# EAGLE design blinkmusb_b1_pcbjackmlf (EAGLE 5.11)
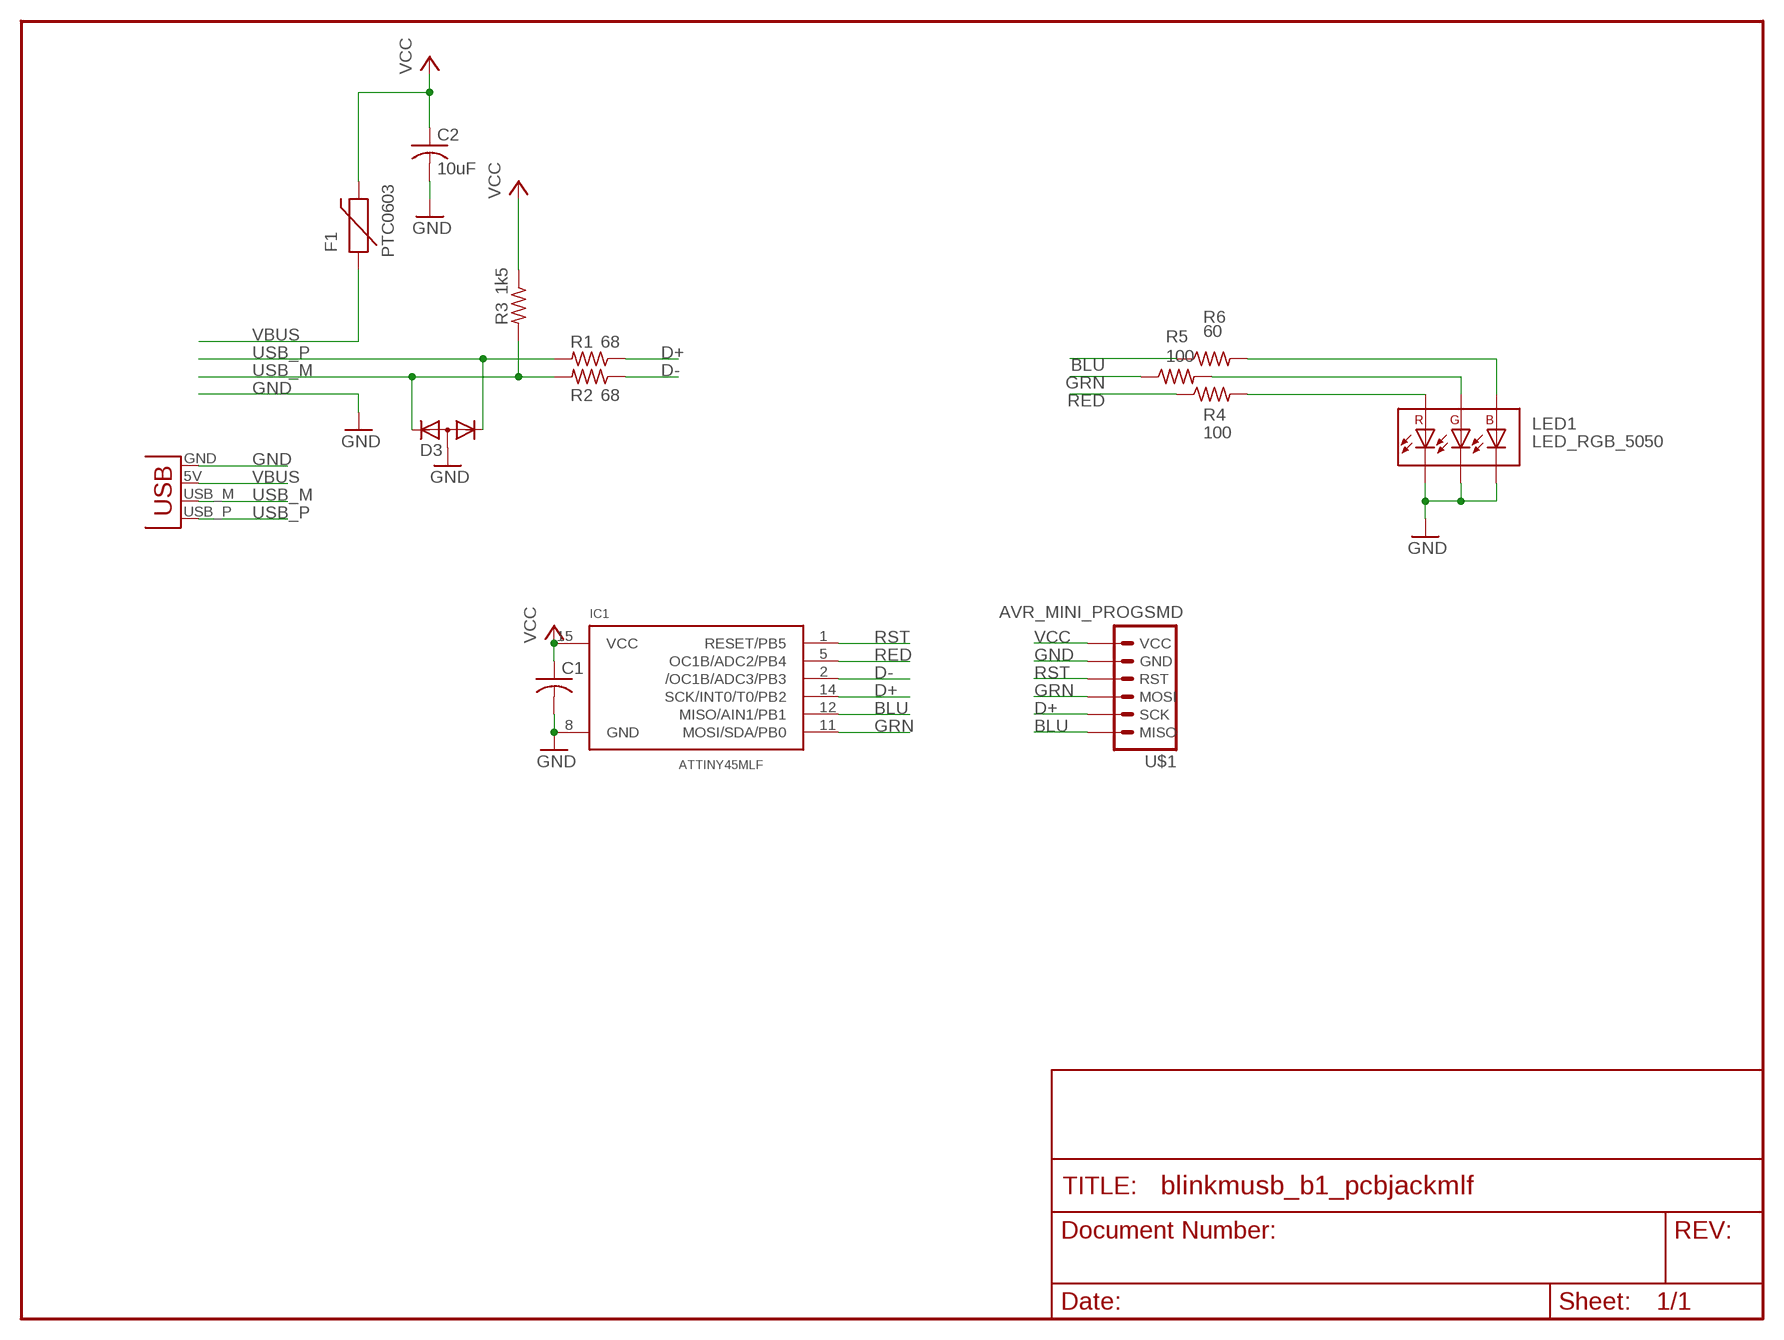
[diagram p0: schematic, sheet 1]

## Parts
C1  C-USC0603  [C0603]
C2  10uF  C-USC0805  [C0805]
D3  DIODE-2CA|ACSOT23  [SOT23]
F1  PTC0603  [0603]
IC1  ATTINY45MLF  [MLF20]
LED1  LED_RGB_5050  [LED_5050]
R1  68  R-US_R0603  [R0603]
R2  68  R-US_R0603  [R0603]
R3  1k5  R-US_R0603  [R0603]
R4  100  R-US_R0603  [R0603]
R5  100  R-US_R0603  [R0603]
R6  60  R-US_R0603  [R0603]
U$1  AVR_MINI_PROGSMD  [AVR_MINI_PROG]
X2  USBPCB  [USB-A-PCB]

## Nets
BLU: IC1.12(MISO/AIN1/PB1) R6.1 U$1.6(MISO)
D+: IC1.14(SCK/INT0/T0/PB2) R1.1 U$1.5(SCK)
D-: IC1.2(/OC1B/ADC3/PB3) R2.1
GND: C1.2 C2.2 D3.3(A) IC1.8(GND) LED1.P$4(C2) LED1.P$5(C1) LED1.P$6(C0) U$1.2(GND) X2.GND
GRN: IC1.11(MOSI/SDA/PB0) R5.1 U$1.4(MOSI)
RBLU: LED1.P$3(A2) R6.2
RED: IC1.5(OC1B/ADC2/PB4) R4.1
RGRN: LED1.P$2(A1) R5.2
RRED: LED1.P$1(A0) R4.2
RST: IC1.1(RESET/PB5) U$1.3(RST)
USB_M: D3.2(K2) R2.2 R3.2 X2.USB_M(D-)
USB_P: D3.1(K1) R1.2 X2.USB_P(D+)
VBUS: F1.1 X2.5V(VBUS)
VCC: C1.1 C2.1 F1.2 IC1.15(VCC) R3.1 U$1.1(VCC)

## Library data of the parts
C1 C2 = rcl:C-US: CAPACITOR, American symbol
D3 = diode:DIODE-2CA|AC: Dual DIODE Cathode-Anode|Anode-Cathode
F1 = SparkFun-20110517:PTC: Resettable Fuse PTC Resettable Fuse. Spark Fun Electronics SKU : COM-08357
IC1 = todstuff:ATTINY45
LED1 = todstuff:LED_RGB_5050
R1-R6 = rcl:R-US_: RESISTOR, American symbol
U$1 = SparkFun-20110517:AVR_MINI_PROG
X2 = SparkFun-20110517:USB: USB Connectors USB-B-PTH is fully proven SKU : PRT-00139 USB-miniB is fully proven SKU : PRT-00587 USB-A-PCB is untested. USB-A-H is throughly reviewed, but untested. Spark Fun Electronics SKU : PRT-00437 USB-B-SMT is throughly reviewed, but untested. Needs silkscreen touching up. USB-A-S has not been used/tested USB-MB-H has not been used/tested

## Board
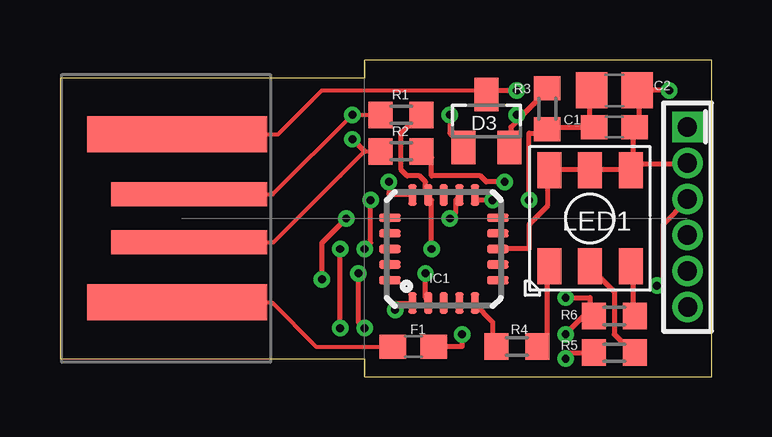
[diagram p1: board, top side]
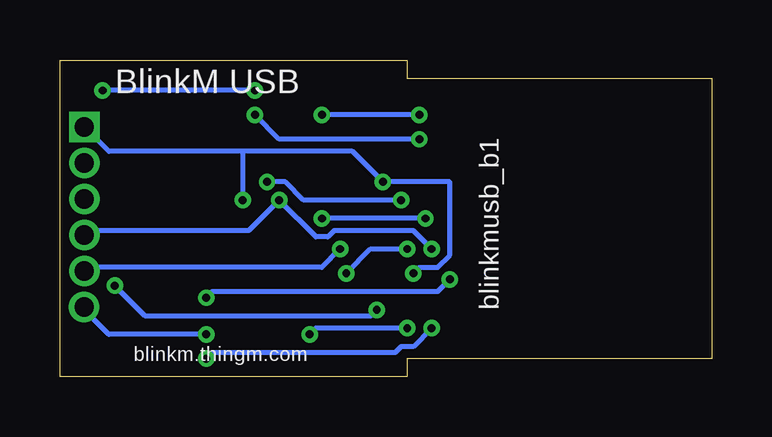
[diagram p2: board, bottom side, seen from below]

Size 27.18 x 13.21 mm. Coordinates in mm from the lower left corner, seen from the top.
Outline: 0,0.76 12.7,0.76 12.7,0 27.18,0 27.18,0.76 27.18,12.45 27.18,13.21 20.32,13.21 12.7,13.21 12.7,12.45 0,12.45 0,0.76
Copper layers (1*16): Top 0.0356mm / dielectric 1.5011mm / Bottom 0.0356mm
Design rules "LaenPCBOrder *": minimum track width 8mil, minimum drill 13mil, track to track 6mil, track to pad 8mil, pad to pad 8mil, via to via 8mil, smd to smd 6mil, copper to edge 15mil, drill to drill 8mil, minimum pad ring 7mil, minimum via ring 7mil, stop-mask expansion 4mil, vias tented up to drill 25mil, thermal gap 10mil
tRestrict: area 0,0 to 10.2,12.7
bRestrict: area 0,0 to 10.2,12.7

### Footprints (pad centres in the part's own frame; a part is rotated, then mirrored left to right if it is on the bottom)
C0603 = smd 1.1 x 1: 1 -0.85,0; 2 0.85,0
C0805 = smd 1.3 x 1.5: 1 -0.95,0; 2 0.95,0
SOT23 = smd 1 x 1.4: 1 -0.95,-1.1; 2 0.95,-1.1; 3 0,1.1
0603 = smd 1.1 x 1: 1 -0.85,0; 2 0.85,0
MLF20 = smd 0.9 x 0.35: 1 -2.25,1.3; 2 -2.25,0.65; 3 -2.25,0; 4 -2.25,-0.65; 5 -2.25,-1.3; 11 2.25,-1.3; 12 2.25,-0.65; 13 2.25,0; 14 2.25,0.65; 15 2.25,1.3 | smd 0.35 x 0.9: 6 -1.3,-2.25; 7 -0.65,-2.25; 8 0,-2.25; 9 0.65,-2.25; 10 1.3,-2.25; 16 1.3,2.25; 17 0.65,2.25; 18 0,2.25; 19 -0.65,2.25; 20 -1.3,2.25
LED_5050 = smd 1 x 1.5: P$1 1.7,2; P$2 0,2; P$3 -1.7,2; P$4 -1.7,-2; P$5 0,-2; P$6 1.7,-2
R0603 = smd 1 x 1.1: 1 -0.85,0; 2 0.85,0
AVR_MINI_PROG = drill 0.8 pad 1.27 square: 1 0,0 | drill 0.8 pad 1.27 round: 2 1.5,0; 3 3,0; 4 4.5,0; 5 6,0; 6 7.5,0.01
USB-A-PCB = smd 7.5 x 1.5: 5V -0.2,-3.5; GND -0.2,3.5 | smd 6.5 x 1: USB_M 0.3,-1; USB_P 0.3,1

### Placement (x,y rotation side)
C1  23.11,10.41 0 top
C2  23.11,11.94 0 top
D3  17.78,10.67 0 top
F1  14.73,1.27 0 top
IC1  16,5.33 90 top
LED1  22.1,6.6 180 top
R1  14.22,10.92 180 top
R2  14.22,9.4 180 top
R3  20.32,11.18 90 top
R4  19.05,1.27 0 top
R5  23.11,1.02 0 top
R6  23.11,2.54 0 top
U$1  26.16,10.41 270 top
X2  5.08,6.6 0 top

### Tracks (layer width: path | path; a pad name or v marks a point on that pad's centre or on a via)
BLU  (via drill 0.33)
  Top 0.203: v16.26,6.6 16.51,6.86 16.51,7.37 IC1.12 | v11.94,6.6 10.92,5.59 v10.92,4.06 | v21.08,3.3 22.1,3.3 22.1,2.79 | 22.1,2.79 22.1,2.54 R6.1 22.1,2.79 | 22.1,2.79 v21.08,1.78
  Bottom 0.203: v11.94,6.6 v16.26,6.6 | v10.92,4.06 11.43,3.56 20.83,3.56 v21.08,3.3 | v21.08,1.78 25.15,1.78 26.16,2.79 U$1.6
D+  (via drill 0.33)
  Top 0.203: R1.1 14.99,10.92 14.22,10.16 14.22,8.64 14.48,8.38 14.99,8.38 15.24,8.13 15.24,7.62 IC1.14 15.49,7.37 v15.49,5.33
  Bottom 0.203: v15.49,5.33 16.26,4.57 26.16,4.57 U$1.5
D-  (via drill 0.33)
  Top 0.203: v15.24,4.32 15.24,3.3 IC1.2 | v12.7,5.33 12.95,5.59 v12.95,7.37 | v18.54,8.13 17.78,8.13 17.53,8.38 15.49,8.38 15.49,9.14 15.24,9.4 R2.1
  Bottom 0.203: v15.24,4.32 14.22,5.33 v12.7,5.33 | v12.95,7.37 17.02,7.37 17.78,8.13 v18.54,8.13
GND  (via drill 0.33)
  Top 0.165: X2.GND 9.09,10.1 10.92,11.94 17.61,11.94 D3.3
  Top 0.203: 24.13,11.94 24.13,10.41 C1.2 23.88,10.41 23.88,8.89 | 24.13,11.94 C2.2 24.13,11.94 | IC1.8 18.29,5.33 19.56,5.33 19.56,6.35 20.32,7.11 20.32,8.38 LED1.P$6 20.57,8.64 22.1,8.64 | 22.1,8.64 LED1.P$5 22.1,8.64 | 22.1,8.64 23.62,8.64 LED1.P$4 | 23.88,8.89 23.88,8.64 LED1.P$4 | 23.88,8.89 26.16,8.89 U$1.2 | 23.88,8.89 LED1.P$4 | v25.4,11.94 24.13,11.94 | v19.05,11.94 17.78,11.94 D3.3
  Bottom 0.203: v19.05,11.94 v25.4,11.94
GRN  (via drill 0.33)
  Top 0.203: v18.03,7.37 17.27,7.37 IC1.11 | v21.08,0.76 21.08,1.02 22.1,1.02 R5.1 | v11.68,2.03 v11.68,5.33
  Bottom 0.203: U$1.4 26.16,6.1 19.3,6.1 v18.03,7.37 16.51,5.84 16,5.84 15.75,6.1 12.45,6.1 v11.68,5.33 | v21.08,0.76 20.83,1.02 13.21,1.02 12.95,1.27 12.45,1.27 v11.68,2.03
RBLU
  Top 0.203: R6.2 23.88,2.54 23.88,4.57 LED1.P$3
RED
  Top 0.203: IC1.5 17.27,3.05 18.03,2.29 18.03,1.27 R4.1
RGRN
  Top 0.203: R5.2 23.88,1.02 23.11,1.78 23.11,3.56 22.1,4.57 LED1.P$2
RRED
  Top 0.203: R4.2 20.07,1.27 20.32,1.52 20.32,4.57 LED1.P$1
RST  (via drill 0.33)
  Top 0.203: v13.97,2.79 13.97,3.05 14.73,3.05 IC1.1 | v24.89,3.81 25.15,4.06 25.15,6.35 26.16,7.37 U$1.3
  Bottom 0.203: v13.97,2.79 14.22,2.54 23.62,2.54 v24.89,3.81
USB_M  (via drill 0.33)
  Top 0.165: X2.USB_M 8.91,5.6 11.68,8.38 12.7,9.4 R2.2
  Top 0.203: 19.3,10.92 18.8,10.41 18.8,9.65 D3.2 | 19.3,10.92 20.32,11.94 R3.2 | v19.05,10.92 19.3,10.92 | 12.7,9.4 v12.19,9.91
  Bottom 0.203: v19.05,10.92 18.03,9.91 v12.19,9.91
USB_P  (via drill 0.33)
  Top 0.165: 13.21,10.92 R1.2 v12.19,10.92 8.87,7.6 X2.USB_P
  Top 0.203: v16.26,10.92 16.26,10.16 16.76,9.65 D3.1
  Bottom 0.203: v12.19,10.92 v16.26,10.92
VBUS
  Top 0.165: X2.5V 8.83,3.1 10.67,1.27 F1.1
VCC  (via drill 0.33)
  Top 0.203: 22.1,10.41 20.32,10.41 R3.1 20.32,10.16 19.56,10.16 v19.56,7.37 | 22.1,10.41 C1.1 22.1,10.41 | 22.1,10.41 22.1,11.94 C2.1 | v13.72,8.13 13.72,7.62 14.73,7.62 IC1.15 | v16.76,1.78 16.76,1.27 15.75,1.27 F1.2 | v12.7,2.03 12.45,2.29 v12.45,4.32
  Bottom 0.203: 19.56,9.4 25.15,9.4 U$1.1 | 19.56,9.4 14.99,9.4 v13.72,8.13 10.92,8.13 10.92,5.08 11.43,4.57 12.19,4.57 v12.45,4.32 | v16.76,1.78 16.51,2.03 v12.7,2.03 | 19.56,9.4 v19.56,7.37

### Text on the board
bPlace: BlinkM USB | blinkmusb_b1 | blinkm.thingm.com